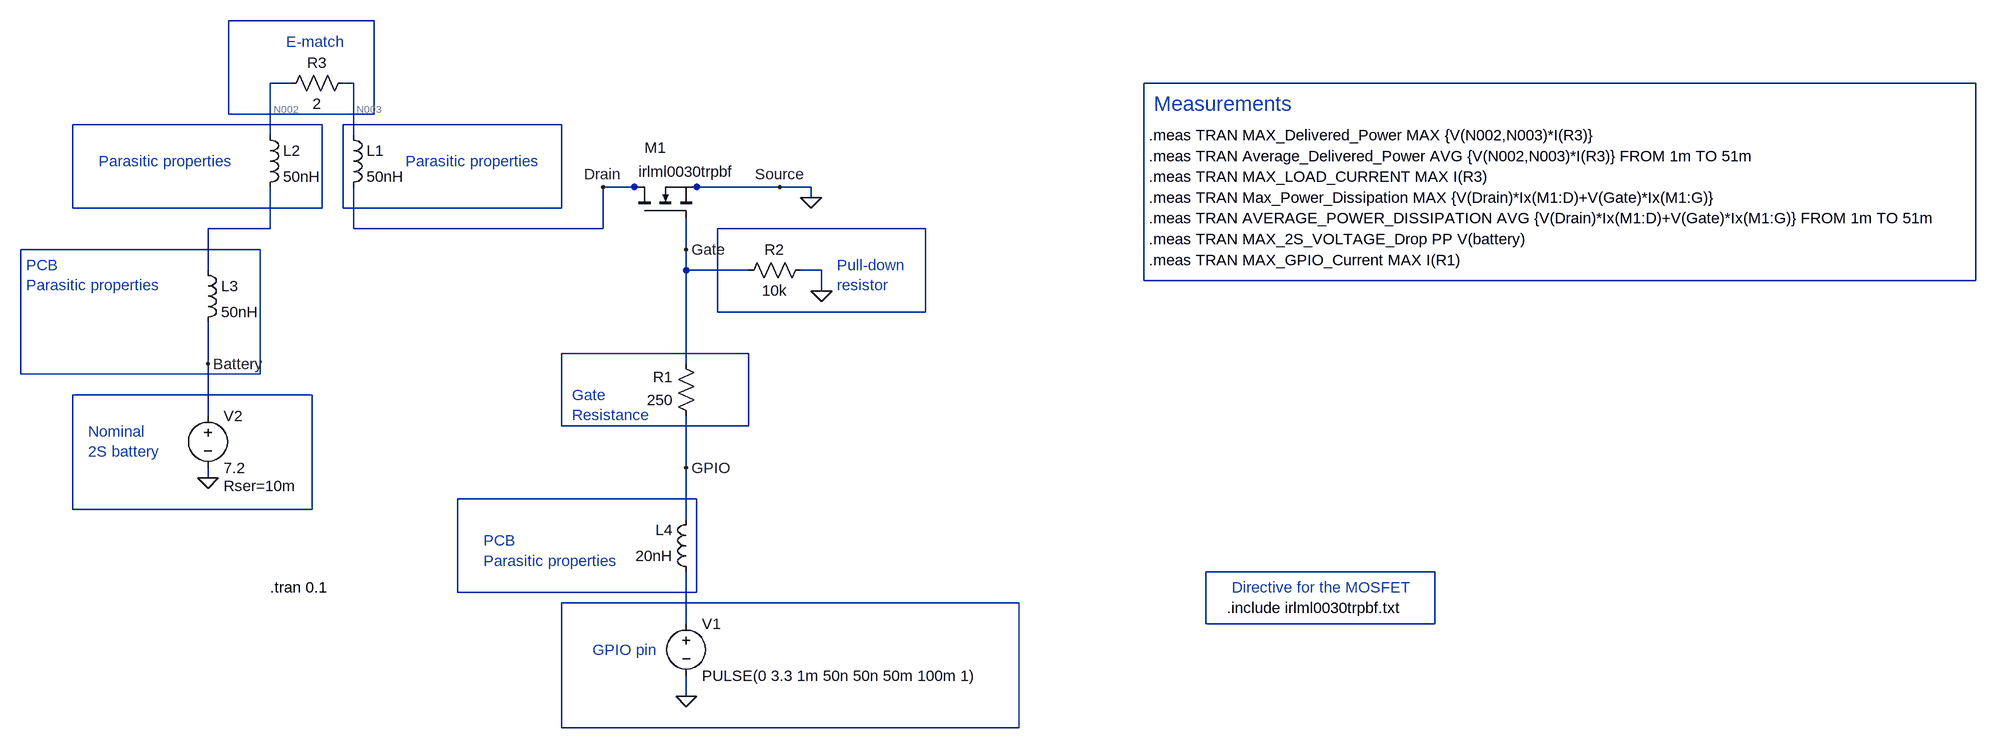
[diagram p0: schematic nchannelMOSFET.asc]
nchannelMOSFET.asc, the LTspice schematic file:
Version 4.1
SHEET 1 2304 948
WIRE -176 -144 -400 -144
WIRE -304 -48 -336 -48
WIRE -208 -48 -224 -48
WIRE 2288 -48 1008 -48
WIRE -400 0 -400 -144
WIRE -176 0 -176 -144
WIRE -176 0 -400 0
WIRE -256 16 -640 16
WIRE 112 16 -224 16
WIRE -336 32 -336 -48
WIRE -208 32 -208 -48
WIRE 224 112 176 112
WIRE 240 112 224 112
WIRE 320 112 272 112
WIRE 448 112 320 112
WIRE 496 112 448 112
WIRE 496 128 496 112
WIRE -640 144 -640 16
WIRE -256 144 -256 16
WIRE -256 144 -640 144
WIRE -224 144 -224 16
WIRE 112 144 112 16
WIRE 112 144 -224 144
WIRE -336 176 -336 112
WIRE -336 176 -432 176
WIRE -208 176 -208 112
WIRE 176 176 176 112
WIRE 176 176 -208 176
WIRE 672 176 352 176
WIRE -352 208 -720 208
WIRE 304 208 304 160
WIRE -432 240 -432 176
WIRE 304 240 304 208
WIRE 400 240 304 240
WIRE 512 240 480 240
WIRE 1008 256 1008 -48
WIRE 2288 256 2288 -48
WIRE 2288 256 1008 256
WIRE 512 272 512 240
WIRE 352 304 352 176
WIRE 672 304 672 176
WIRE 672 304 352 304
WIRE 400 368 112 368
WIRE -432 384 -432 320
WIRE 304 384 304 240
WIRE -720 400 -720 208
WIRE -352 400 -352 208
WIRE -352 400 -720 400
WIRE -272 432 -640 432
WIRE -432 464 -432 384
WIRE 112 480 112 368
WIRE 400 480 400 368
WIRE 400 480 112 480
WIRE 304 544 304 464
WIRE -432 560 -432 544
WIRE 320 592 -48 592
WIRE -640 608 -640 432
WIRE -272 608 -272 432
WIRE -272 608 -640 608
WIRE 304 624 304 544
WIRE 1456 704 1104 704
WIRE -48 736 -48 592
WIRE 320 736 320 592
WIRE 320 736 -48 736
WIRE 816 752 112 752
WIRE 304 784 304 704
WIRE 1104 784 1104 704
WIRE 1456 784 1456 704
WIRE 1456 784 1104 784
WIRE 304 896 304 864
WIRE 112 944 112 752
WIRE 816 944 816 752
WIRE 816 944 112 944
FLAG 304 896 0
FLAG 512 272 0
FLAG -432 560 0
FLAG 496 128 0
FLAG 304 208 Gate
FLAG 448 112 Source
FLAG 176 112 Drain
FLAG -432 384 Battery
FLAG 304 544 GPIO
SYMBOL nmos 224 160 R270
WINDOW 0 109 16 VRight 2
WINDOW 3 72 7 VRight 2
SYMATTR InstName M1
SYMATTR Value irlml0030trpbf
SYMATTR Prefix X
SYMBOL voltage 304 768 R0
WINDOW 123 0 0 Left 0
WINDOW 39 0 0 Left 0
SYMATTR InstName V1
SYMATTR Value PULSE(0 3.3 1m 50n 50n 50m 100m 1)
SYMBOL res 320 480 R180
WINDOW 0 36 76 Left 2
WINDOW 3 36 40 Left 2
SYMATTR InstName R1
SYMATTR Value 250
SYMBOL res 384 256 R270
WINDOW 0 32 56 VTop 2
WINDOW 3 0 56 VBottom 2
SYMATTR InstName R2
SYMATTR Value 10k
SYMBOL voltage -432 448 R0
WINDOW 123 0 0 Left 0
WINDOW 39 24 124 Left 2
SYMATTR InstName V2
SYMATTR Value 7.2
SYMATTR SpiceLine Rser=10m
SYMBOL res -320 -32 R270
WINDOW 0 32 56 VTop 2
WINDOW 3 0 56 VBottom 2
SYMATTR InstName R3
SYMATTR Value 2
SYMBOL ind -224 16 R0
SYMATTR InstName L1
SYMATTR Value 50nH
SYMATTR SpiceLine Rser=20m Cpar=100pF
SYMBOL ind -352 16 R0
SYMATTR InstName L2
SYMATTR Value 50nH
SYMATTR SpiceLine Rser=20m Cpar=100pF
SYMBOL ind -448 224 R0
SYMATTR InstName L3
SYMATTR Value 50nH
SYMATTR SpiceLine Rser=20m Cpar=100pF
SYMBOL ind 320 720 R180
WINDOW 0 36 80 Left 2
WINDOW 3 36 40 Left 2
SYMATTR InstName L4
SYMATTR Value 20nH
SYMATTR SpiceLine Rser=20m Cpar=50pF
TEXT 1136 760 Left 2 !.include irlml0030trpbf.txt
TEXT 160 824 Left 2 ;GPIO pin
TEXT 1144 728 Left 2 ;Directive for the MOSFET
TEXT 128 432 Left 2 ;Gate\nResistance
TEXT 536 232 Left 2 ;Pull-down\nresistor
TEXT -616 488 Left 2 ;Nominal\n2S battery
TEXT -312 -112 Left 2 ;E-match
TEXT -336 728 Left 2 !.tran 0.1
TEXT 1016 96 Left 2 !.meas TRAN MAX_LOAD_CURRENT MAX I(R3)
TEXT 1016 128 Left 2 !.meas TRAN Max_Power_Dissipation MAX {V(Drain)*Ix(M1:D)+V(Gate)*Ix(M1:G)}
TEXT 1016 160 Left 2 !.meas TRAN AVERAGE_POWER_DISSIPATION AVG {V(Drain)*Ix(M1:D)+V(Gate)*Ix(M1:G)} FROM 1m TO 51m
TEXT 1016 192 Left 2 !.meas TRAN MAX_2S_VOLTAGE_Drop PP V(battery)
TEXT 1016 224 Left 2 !.meas TRAN MAX_GPIO_Current MAX I(R1)
TEXT 1016 64 Left 2 !.meas TRAN Average_Delivered_Power AVG {V(N002,N003)*I(R3)} FROM 1m TO 51m
TEXT 1016 32 Left 2 !.meas TRAN MAX_Delivered_Power MAX {V(N002,N003)*I(R3)}
TEXT 1024 -16 Left 3 ;Measurements
TEXT -600 72 Left 2 ;Parasitic properties
TEXT -128 72 Left 2 ;Parasitic properties
TEXT -712 232 Left 2 ;PCB\nParasitic properties
TEXT -8 656 Left 2 ;PCB\nParasitic properties

The netlist it stands for:
* nchannelMOSFET.asc
X§M1 Drain Gate 0 irlml0030trpbf  ; pins D G S
V1 N015 0 PULSE(0 3.3 1m 50n 50n 50m 100m 1)
R1 GPIO Gate 250
R2 Gate 0 10k
V2 Battery 0 7.2 Rser=10m
R3 N002 N003 2
L1 N003 Drain 50nH Rser=20m Cpar=100pF
L2 N002 N007 50nH Rser=20m Cpar=100pF
L3 N007 Battery 50nH Rser=20m Cpar=100pF
L4 N015 GPIO 20nH Rser=20m Cpar=50pF
.include irlml0030trpbf.txt
* GPIO pin
* Directive for the MOSFET
* Gate
* Resistance
* Pull-down
* resistor
* Nominal
* 2S battery
* E-match
.tran 0.1
.meas TRAN MAX_LOAD_CURRENT MAX I(R3)
.meas TRAN Max_Power_Dissipation MAX {V(Drain)*Ix(M1:D)+V(Gate)*Ix(M1:G)}
.meas TRAN AVERAGE_POWER_DISSIPATION AVG {V(Drain)*Ix(M1:D)+V(Gate)*Ix(M1:G)} FROM 1m TO 51m
.meas TRAN MAX_2S_VOLTAGE_Drop PP V(battery)
.meas TRAN MAX_GPIO_Current MAX I(R1)
.meas TRAN Average_Delivered_Power AVG {V(N002,N003)*I(R3)} FROM 1m TO 51m
.meas TRAN MAX_Delivered_Power MAX {V(N002,N003)*I(R3)}
* Measurements
* Parasitic properties
* Parasitic properties
* PCB
* Parasitic properties
* PCB
* Parasitic properties
.backanno
.end

* Results of the author's LTspice run, read from the files saved beside the schematic
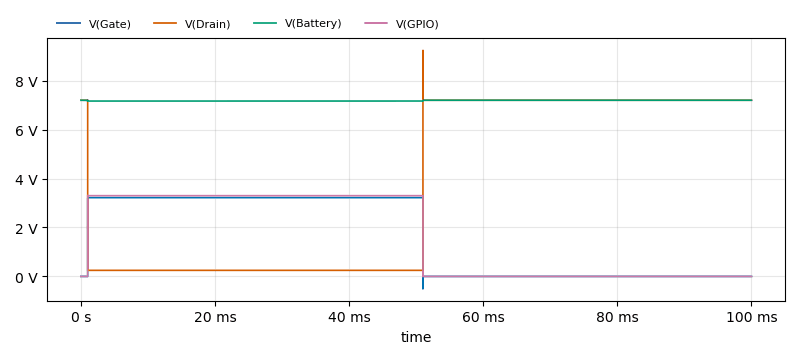
[diagram p1: Transient Analysis of nchannelMOSFET.asc, plotted from the saved traces]
* Transient Analysis, 1 run:
*   V(Gate): min -505.9 mV, max 3.22 V, average 1.61 V, rms 2.277 V, last 1.782 µV
*   V(Drain): min 248.5 mV, max 9.239 V, average 3.724 V, rms 5.094 V, last 7.2 V
*   V(Battery): min 7.166 V, max 7.2 V, average 7.183 V, rms 7.183 V, last 7.2 V
*   V(GPIO): min -11.24 mV, max 3.31 V, average 1.65 V, rms 2.333 V, last 0 V
* From the log:
*   max_load_current: MAX(I(R3))=3.35820055008 FROM 0 TO 0.1
*   max_power_dissipation: MAX({V(Drain)*Ix(M1:D)+V(Gate)*Ix(M1:G)})=9.01634132716 FROM 0 TO 0.1
*   average_power_dissipation: AVG({V(Drain)*Ix(M1:D)+V(Gate)*Ix(M1:G)} )=0.834617284007 FROM 0.001 TO 0.051
*   max_2s_voltage_drop: PP(V(battery))=0.0340008735657 FROM 0 TO 0.1
*   max_gpio_current: MAX(I(R1))=0.0103949792683 FROM 0 TO 0.1
*   average_delivered_power: AVG({V(N002,N003)*I(R3)} )=22.5548205736 FROM 0.001 TO 0.051
*   max_delivered_power: MAX({V(N002,N003)*I(R3)})=22.5550212686 FROM 0 TO 0.1